# Altium project power.PrjPcb
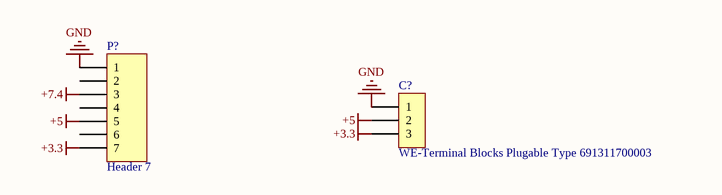
[diagram p0: power.SchDoc]
1 sheet, 2 parts. Net scope: global (net labels, ports and power ports of the same name join across sheets).
Board file: power.PcbDoc

## Sheet power.SchDoc
size A4

### Parts
C?  WE-Terminal Blocks Plugable Type 691311700003  [691311700003]
P?  Header 7  [HDR1X7]

### Nets
+3.3: C?.3 P?.7
+5: C?.2 P?.5
+7.4: P?.3
GND: C?.1 P?.1

Not connected (* = marked no-connect by the designer): P? 2 4 6

### Library data of the parts
C? = WE-Terminal Blocks Plugable Type 691311700003: WR-TBL Terminal block - serie 3117 - 5.00mm; Manufacturer: W¨¹rth Elektronik eiSos GmbH; ComponentLink1 Description: Manufacturer; ComponentLink2 Description: Datasheet; NoPins: 03; Created Date: 6 January 2014; partNo: 691311700003; ComponentLink1URL: http://www.we-online.com; ComponentLink2URL: http://katalog.we-online.de/em/datasheet/6913117000xx.pdf; Created by: Karrer Zheng
P? = Header 7: Header, 7-Pin; LatestRevisionDate: 17-Jul-2002; LatestRevisionNote: Re-released for DXP Platform.; Publisher: Altium Limited